# EAGLE schematic piggyboard (EAGLE 6.5.0)
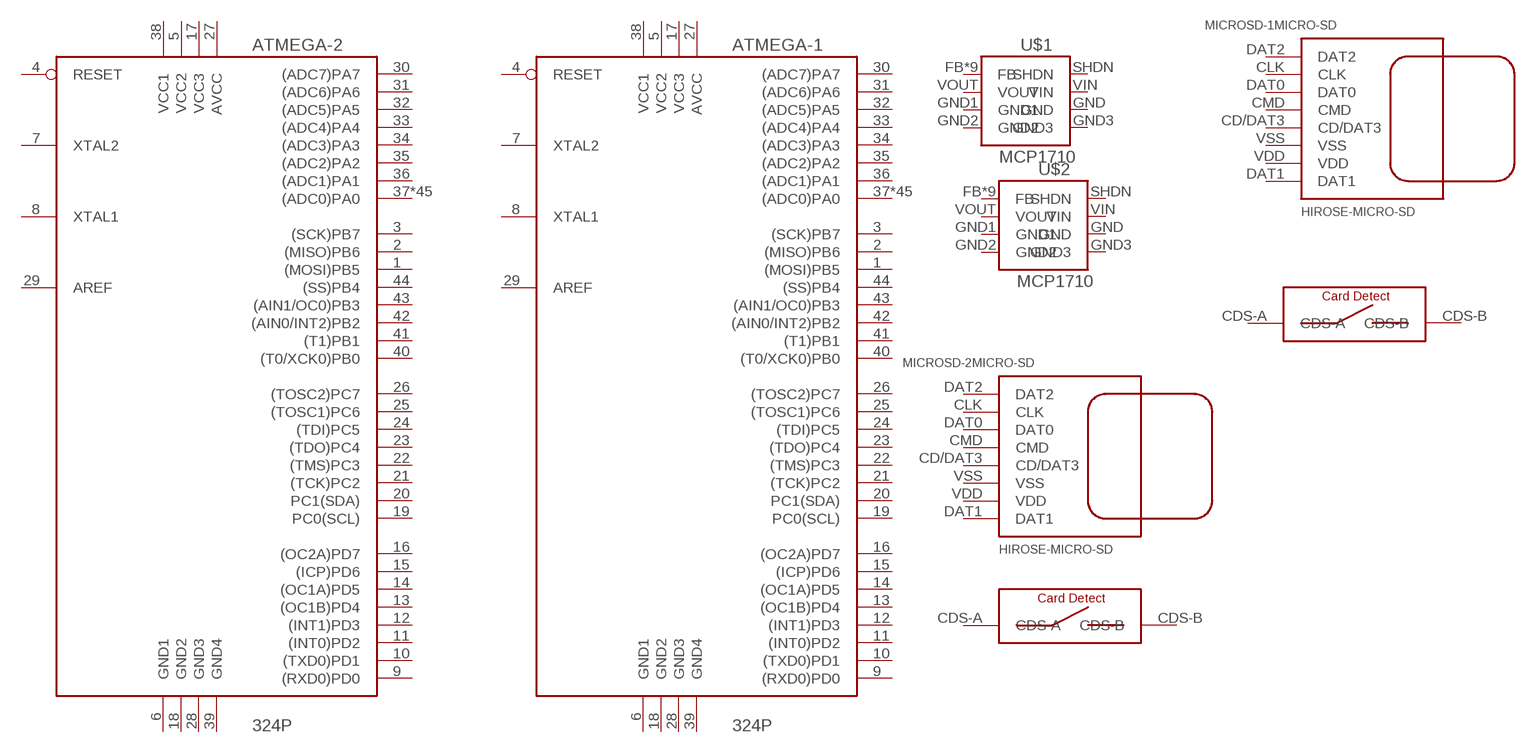
[diagram p0: schematic, sheet 1]

## Parts
ATMEGA-1  324P  ATMEGA324P  [TQFP-44]
ATMEGA-2  324P  ATMEGA324P  [TQFP-44]
MICROSD-1  HIROSE-MICRO-SD  [HIROSE-MICROSD-V2]
MICROSD-2  HIROSE-MICRO-SD  [HIROSE-MICROSD-V2]
U$1  MCP1710  [DFN-2X2]
U$2  MCP1710  [DFN-2X2]
Unconnected: ATMEGA-1.1((MOSI)PB5) ATMEGA-1.2((MISO)PB6) ATMEGA-1.3((SCK)PB7) ATMEGA-1.4(RESET) ATMEGA-1.5(VCC2) ATMEGA-1.6(GND1) ATMEGA-1.7(XTAL2) ATMEGA-1.8(XTAL1) ATMEGA-1.9((RXD0)PD0) ATMEGA-1.10((TXD0)PD1) ATMEGA-1.11((INT0)PD2) ATMEGA-1.12((INT1)PD3) ATMEGA-1.13((OC1B)PD4) ATMEGA-1.14((OC1A)PD5) ATMEGA-1.15((ICP)PD6) ATMEGA-1.16((OC2A)PD7) ATMEGA-1.17(VCC3) ATMEGA-1.18(GND2) ATMEGA-1.19(PC0(SCL)) ATMEGA-1.20(PC1(SDA)) ATMEGA-1.21((TCK)PC2) ATMEGA-1.22((TMS)PC3) ATMEGA-1.23((TDO)PC4) ATMEGA-1.24((TDI)PC5) ATMEGA-1.25((TOSC1)PC6) ATMEGA-1.26((TOSC2)PC7) ATMEGA-1.27(AVCC) ATMEGA-1.28(GND3) ATMEGA-1.29(AREF) ATMEGA-1.30((ADC7)PA7) ATMEGA-1.31((ADC6)PA6) ATMEGA-1.32((ADC5)PA5) ATMEGA-1.33((ADC4)PA4) ATMEGA-1.34((ADC3)PA3) ATMEGA-1.35((ADC2)PA2) ATMEGA-1.36((ADC1)PA1) ATMEGA-1.37((ADC0)PA0) ATMEGA-1.38(VCC1) ATMEGA-1.39(GND4) ATMEGA-1.40((T0/XCK0)PB0) ATMEGA-1.41((T1)PB1) ATMEGA-1.42((AIN0/INT2)PB2) ATMEGA-1.43((AIN1/OC0)PB3) ATMEGA-1.44((SS)PB4) ATMEGA-1.P$1((ADC0)PA0) ATMEGA-1.P$2((ADC0)PA0) ATMEGA-1.P$3((ADC0)PA0) ATMEGA-1.P$4((ADC0)PA0) ATMEGA-1.P$5((ADC0)PA0) ATMEGA-1.P$6((ADC0)PA0) ATMEGA-1.P$7((ADC0)PA0) ATMEGA-1.P$8((ADC0)PA0) ATMEGA-1.P$9((ADC0)PA0) ATMEGA-1.P$10((ADC0)PA0) ATMEGA-1.P$11((ADC0)PA0) ATMEGA-1.P$12((ADC0)PA0) ATMEGA-1.P$13((ADC0)PA0) ATMEGA-1.P$14((ADC0)PA0) ATMEGA-1.P$15((ADC0)PA0) ATMEGA-1.P$16((ADC0)PA0) ATMEGA-1.P$17((ADC0)PA0) ATMEGA-1.P$18((ADC0)PA0) ATMEGA-1.P$19((ADC0)PA0) ATMEGA-1.P$20((ADC0)PA0) ATMEGA-1.P$21((ADC0)PA0) ATMEGA-1.P$22((ADC0)PA0) ATMEGA-1.P$23((ADC0)PA0) ATMEGA-1.P$24((ADC0)PA0) ATMEGA-1.P$25((ADC0)PA0) ATMEGA-1.P$26((ADC0)PA0) ATMEGA-1.P$27((ADC0)PA0) ATMEGA-1.P$28((ADC0)PA0) ATMEGA-1.P$29((ADC0)PA0) ATMEGA-1.P$30((ADC0)PA0) ATMEGA-1.P$31((ADC0)PA0) ATMEGA-1.P$32((ADC0)PA0) ATMEGA-1.P$33((ADC0)PA0) ATMEGA-1.P$34((ADC0)PA0) ATMEGA-1.P$35((ADC0)PA0) ATMEGA-1.P$36((ADC0)PA0) ATMEGA-1.P$37((ADC0)PA0) ATMEGA-1.P$38((ADC0)PA0) ATMEGA-1.P$39((ADC0)PA0) ATMEGA-1.P$40((ADC0)PA0) ATMEGA-1.P$41((ADC0)PA0) ATMEGA-1.P$42((ADC0)PA0) ATMEGA-1.P$43((ADC0)PA0) ATMEGA-1.P$44((ADC0)PA0) ATMEGA-2.1((MOSI)PB5) ATMEGA-2.2((MISO)PB6) ATMEGA-2.3((SCK)PB7) ATMEGA-2.4(RESET) ATMEGA-2.5(VCC2) ATMEGA-2.6(GND1) ATMEGA-2.7(XTAL2) ATMEGA-2.8(XTAL1) ATMEGA-2.9((RXD0)PD0) ATMEGA-2.10((TXD0)PD1) ATMEGA-2.11((INT0)PD2) ATMEGA-2.12((INT1)PD3) ATMEGA-2.13((OC1B)PD4) ATMEGA-2.14((OC1A)PD5) ATMEGA-2.15((ICP)PD6) ATMEGA-2.16((OC2A)PD7) ATMEGA-2.17(VCC3) ATMEGA-2.18(GND2) ATMEGA-2.19(PC0(SCL)) ATMEGA-2.20(PC1(SDA)) ATMEGA-2.21((TCK)PC2) ATMEGA-2.22((TMS)PC3) ATMEGA-2.23((TDO)PC4) ATMEGA-2.24((TDI)PC5) ATMEGA-2.25((TOSC1)PC6) ATMEGA-2.26((TOSC2)PC7) ATMEGA-2.27(AVCC) ATMEGA-2.28(GND3) ATMEGA-2.29(AREF) ATMEGA-2.30((ADC7)PA7) ATMEGA-2.31((ADC6)PA6) ATMEGA-2.32((ADC5)PA5) ATMEGA-2.33((ADC4)PA4) ATMEGA-2.34((ADC3)PA3) ATMEGA-2.35((ADC2)PA2) ATMEGA-2.36((ADC1)PA1) ATMEGA-2.37((ADC0)PA0) ATMEGA-2.38(VCC1) ATMEGA-2.39(GND4) ATMEGA-2.40((T0/XCK0)PB0) ATMEGA-2.41((T1)PB1) ATMEGA-2.42((AIN0/INT2)PB2) ATMEGA-2.43((AIN1/OC0)PB3) ATMEGA-2.44((SS)PB4) ATMEGA-2.P$1((ADC0)PA0) ATMEGA-2.P$2((ADC0)PA0) ATMEGA-2.P$3((ADC0)PA0) ATMEGA-2.P$4((ADC0)PA0) ATMEGA-2.P$5((ADC0)PA0) ATMEGA-2.P$6((ADC0)PA0) ATMEGA-2.P$7((ADC0)PA0) ATMEGA-2.P$8((ADC0)PA0) ATMEGA-2.P$9((ADC0)PA0) ATMEGA-2.P$10((ADC0)PA0) ATMEGA-2.P$11((ADC0)PA0) ATMEGA-2.P$12((ADC0)PA0) ATMEGA-2.P$13((ADC0)PA0) ATMEGA-2.P$14((ADC0)PA0) ATMEGA-2.P$15((ADC0)PA0) ATMEGA-2.P$16((ADC0)PA0) ATMEGA-2.P$17((ADC0)PA0) ATMEGA-2.P$18((ADC0)PA0) ATMEGA-2.P$19((ADC0)PA0) ATMEGA-2.P$20((ADC0)PA0) ATMEGA-2.P$21((ADC0)PA0) ATMEGA-2.P$22((ADC0)PA0) ATMEGA-2.P$23((ADC0)PA0) ATMEGA-2.P$24((ADC0)PA0) ATMEGA-2.P$25((ADC0)PA0) ATMEGA-2.P$26((ADC0)PA0) ATMEGA-2.P$27((ADC0)PA0) ATMEGA-2.P$28((ADC0)PA0) ATMEGA-2.P$29((ADC0)PA0) ATMEGA-2.P$30((ADC0)PA0) ATMEGA-2.P$31((ADC0)PA0) ATMEGA-2.P$32((ADC0)PA0) ATMEGA-2.P$33((ADC0)PA0) ATMEGA-2.P$34((ADC0)PA0) ATMEGA-2.P$35((ADC0)PA0) ATMEGA-2.P$36((ADC0)PA0) ATMEGA-2.P$37((ADC0)PA0) ATMEGA-2.P$38((ADC0)PA0) ATMEGA-2.P$39((ADC0)PA0) ATMEGA-2.P$40((ADC0)PA0) ATMEGA-2.P$41((ADC0)PA0) ATMEGA-2.P$42((ADC0)PA0) ATMEGA-2.P$43((ADC0)PA0) ATMEGA-2.P$44((ADC0)PA0) MICROSD-1.CD/DAT3(MICRO-SD:CD/DAT3) MICROSD-1.CDS-A(CD:CDS-A) MICROSD-1.CDS-B(CD:CDS-B) MICROSD-1.CLK(MICRO-SD:CLK) MICROSD-1.CMD(MICRO-SD:CMD) MICROSD-1.DAT0(MICRO-SD:DAT0) MICROSD-1.DAT1(MICRO-SD:DAT1) MICROSD-1.DAT2(MICRO-SD:DAT2) MICROSD-1.VDD(MICRO-SD:VDD) MICROSD-1.VSS(MICRO-SD:VSS) MICROSD-2.CD/DAT3(MICRO-SD:CD/DAT3) MICROSD-2.CDS-A(CD:CDS-A) MICROSD-2.CDS-B(CD:CDS-B) MICROSD-2.CLK(MICRO-SD:CLK) MICROSD-2.CMD(MICRO-SD:CMD) MICROSD-2.DAT0(MICRO-SD:DAT0) MICROSD-2.DAT1(MICRO-SD:DAT1) MICROSD-2.DAT2(MICRO-SD:DAT2) MICROSD-2.VDD(MICRO-SD:VDD) MICROSD-2.VSS(MICRO-SD:VSS) U$1.FB U$1.GND U$1.GND1 U$1.GND2 U$1.GND3 U$1.P$1(FB) U$1.P$2(FB) U$1.P$3(FB) U$1.P$4(FB) U$1.P$5(FB) U$1.P$6(FB) U$1.P$7(FB) U$1.P$8(FB) U$1.SHDN U$1.VIN U$1.VOUT U$2.FB U$2.GND U$2.GND1 U$2.GND2 U$2.GND3 U$2.P$1(FB) U$2.P$2(FB) U$2.P$3(FB) U$2.P$4(FB) U$2.P$5(FB) U$2.P$6(FB) U$2.P$7(FB) U$2.P$8(FB) U$2.SHDN U$2.VIN U$2.VOUT

## Library data of the parts
ATMEGA-1 ATMEGA-2 = ATMega324P-piggy:ATMEGA324P
MICROSD-1 MICROSD-2 = hirosemicrosd-piggy:HIROSE-MICRO-SD
U$1 U$2 = MCP1710T-piggy:MCP1710